# Altium schematic sheet Quadrature Mixers [FIXED WITH BIASING].SchDoc
size B
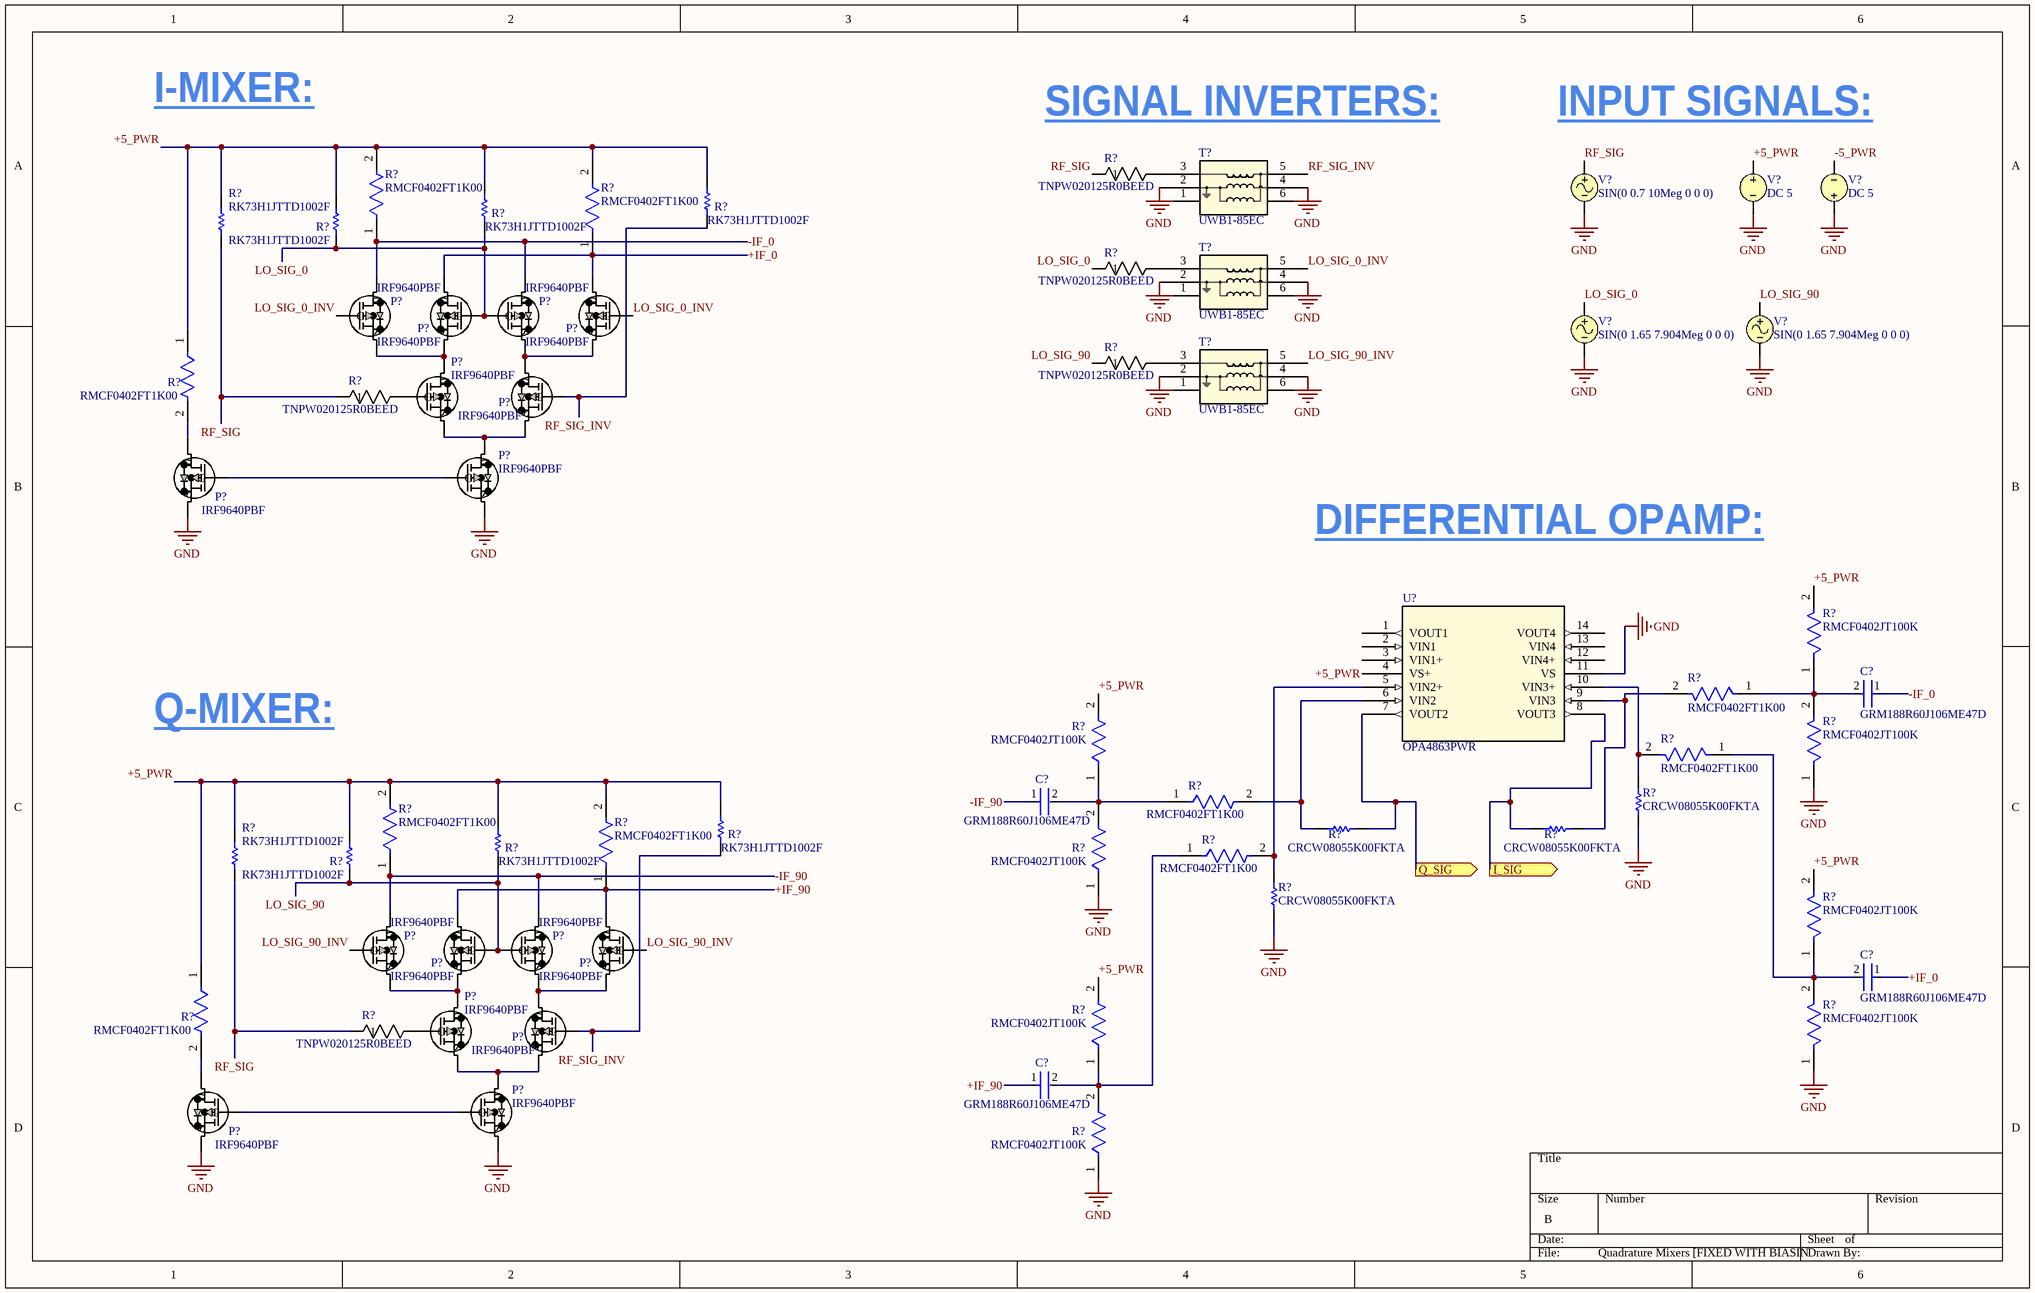
[diagram p0: Quadrature Mixers [FIXED WITH BIASING].SchDoc]

## Parts
(Parts that share a designator on the sheet are numbered #1, #2 ... from top to bottom, then left to right.)
C?#1  GRM188R60J106ME47D  [FP-GRM188-0_1-e0_2_0_55-IPC_A]
C?#2  GRM188R60J106ME47D  [FP-GRM188-0_1-e0_2_0_55-IPC_A]
C?#3  GRM188R60J106ME47D  [FP-GRM188-0_1-e0_2_0_55-IPC_A]
C?#4  GRM188R60J106ME47D  [FP-GRM188-0_1-e0_2_0_55-IPC_A]
P?#1  IRF9640PBF  [TO220AB_VIS]
P?#2  IRF9640PBF  [TO220AB_VIS]
P?#3  IRF9640PBF  [TO220AB_VIS]
P?#4  IRF9640PBF  [TO220AB_VIS]
P?#5  IRF9640PBF  [TO220AB_VIS]
P?#6  IRF9640PBF  [TO220AB_VIS]
P?#7  IRF9640PBF  [TO220AB_VIS]
P?#8  IRF9640PBF  [TO220AB_VIS]
P?#9  IRF9640PBF  [TO220AB_VIS]
P?#10  IRF9640PBF  [TO220AB_VIS]
P?#11  IRF9640PBF  [TO220AB_VIS]
P?#12  IRF9640PBF  [TO220AB_VIS]
P?#13  IRF9640PBF  [TO220AB_VIS]
P?#14  IRF9640PBF  [TO220AB_VIS]
P?#15  IRF9640PBF  [TO220AB_VIS]
P?#16  IRF9640PBF  [TO220AB_VIS]
R?#1  TNPW020125R0BEED  [RES_TNPW0201_VIS]
R?#2  RK73H1JTTD1002F  [RESC1608X55X30ML20T10]
R?#3  RK73H1JTTD1002F  [RESC1608X55X30ML20T10]
R?#4  RK73H1JTTD1002F  [RESC1608X55X30ML20T10]
R?#5  RK73H1JTTD1002F  [RESC1608X55X30ML20T10]
R?#6  RMCF0402FT1K00  [FP-RMCF0402-MFG]
R?#7  RMCF0402FT1K00  [FP-RMCF0402-MFG]
R?#8  TNPW020125R0BEED  [RES_TNPW0201_VIS]
R?#9  RMCF0402FT1K00  [FP-RMCF0402-MFG]
R?#10  TNPW020125R0BEED  [RES_TNPW0201_VIS]
R?#11  TNPW020125R0BEED  [RES_TNPW0201_VIS]
R?#12  RMCF0402JT100K  [FP-RMCF0402-MFG]
R?#13  RMCF0402FT1K00  [FP-RMCF0402-MFG]
R?#14  RMCF0402FT1K00  [FP-RMCF0402-MFG]
R?#15  RMCF0402JT100K  [FP-RMCF0402-MFG]
R?#16  RMCF0402JT100K  [FP-RMCF0402-MFG]
R?#17  RMCF0402FT1K00  [FP-RMCF0402-MFG]
R?#18  CRCW08055K00FKTA  [RESC2013X50X30ML20T20]
R?#19  CRCW08055K00FKTA  [RESC2013X50X30ML20T20]
R?#20  CRCW08055K00FKTA  [RESC2013X50X30ML20T20]
R?#21  RK73H1JTTD1002F  [RESC1608X55X30ML20T10]
R?#22  RK73H1JTTD1002F  [RESC1608X55X30ML20T10]
R?#23  RMCF0402FT1K00  [FP-RMCF0402-MFG]
R?#24  RK73H1JTTD1002F  [RESC1608X55X30ML20T10]
R?#25  RK73H1JTTD1002F  [RESC1608X55X30ML20T10]
R?#26  RMCF0402FT1K00  [FP-RMCF0402-MFG]
R?#27  RMCF0402FT1K00  [FP-RMCF0402-MFG]
R?#28  RMCF0402JT100K  [FP-RMCF0402-MFG]
R?#29  CRCW08055K00FKTA  [RESC2013X50X30ML20T20]
R?#30  RMCF0402FT1K00  [FP-RMCF0402-MFG]
R?#31  RMCF0402JT100K  [FP-RMCF0402-MFG]
R?#32  TNPW020125R0BEED  [RES_TNPW0201_VIS]
R?#33  RMCF0402JT100K  [FP-RMCF0402-MFG]
R?#34  RMCF0402JT100K  [FP-RMCF0402-MFG]
R?#35  RMCF0402JT100K  [FP-RMCF0402-MFG]
T?#1  UWB1-85EC  [UWB1UWB2_COC]
T?#2  UWB1-85EC  [UWB1UWB2_COC]
T?#3  UWB1-85EC  [UWB1UWB2_COC]
U?  OPA4863PWR  [PW14_TEX]
V?#1  SIN(0 0.7 10Meg 0 0 0)
V?#2  DC 5
V?#3  DC 5
V?#4  SIN(0 1.65 7.904Meg 0 0 0)
V?#5  SIN(0 1.65 7.904Meg 0 0 0)

## Ports
I_SIG (out), Q_SIG (out)

## Nets
GND: P?#7.3(S) P?#8.3(S) P?#15.3(S) P?#16.3(S) R?#16.1 R?#20.1 R?#28.1 R?#29.1 R?#34.1 R?#35.1 T?#1.2 T?#1.4 T?#2.2 T?#2.4 T?#3.2 T?#3.4 U?.11(VS) V?#1.2 V?#2.2 V?#3.1 V?#4.2 V?#5.2
+5_PWR: R?#2.2 R?#3.2 R?#4.2 R?#5.2 R?#6.2 R?#7.2 R?#9.1 R?#12.2 R?#15.2 R?#21.2 R?#22.2 R?#24.2 R?#25.2 R?#26.2 R?#27.2 R?#30.1 R?#31.2 R?#33.2 U?.4(VS+) V?#2.1
+IF_0: C?#3.1 P?#2.2(D) P?#4.2(D) R?#7.1
+IF_90: C?#4.1 P?#10.2(D) P?#12.2(D) R?#27.1
-5_PWR: V?#3.2
-IF_0: C?#1.1 P?#1.2(D) P?#3.2(D) R?#6.1
-IF_90: C?#2.1 P?#9.2(D) P?#11.2(D) R?#26.1
I_SIG: R?#19.1 U?.8(VOUT3) ; port I_SIG
LO_SIG_0: P?#2.1(G) P?#3.1(G) R?#3.1 R?#5.1 R?#8.1 V?#4.1
LO_SIG_0_INV: P?#1.1(G) P?#4.1(G) T?#2.5
LO_SIG_90: P?#10.1(G) P?#11.1(G) R?#10.1 R?#22.1 R?#25.1 V?#5.1
LO_SIG_90_INV: P?#9.1(G) P?#12.1(G) T?#3.5
Q_SIG: R?#18.2 U?.7(VOUT2) ; port Q_SIG
RF_SIG: R?#1.1 R?#4.1 R?#11.1 R?#24.1 R?#32.1 V?#1.1
RF_SIG_INV: P?#6.1(G) P?#14.1(G) R?#2.1 R?#21.1 T?#1.5
NetC?#1_2: C?#1.2 R?#12.1 R?#13.1 R?#16.2
NetC?#2_2: C?#2.2 R?#15.1 R?#17.1 R?#28.2
NetC?#3_2: C?#3.2 R?#14.1 R?#31.1 R?#34.2
NetC?#4_2: C?#4.2 R?#23.1 R?#33.1 R?#35.2
NetP?#1_3: P?#1.3(S) P?#2.3(S) P?#5.2(D)
NetP?#3_3: P?#3.3(S) P?#4.3(S) P?#6.2(D)
NetP?#5_1: P?#5.1(G) R?#11.2
NetP?#5_3: P?#5.3(S) P?#6.3(S) P?#8.2(D)
NetP?#7_1: P?#7.1(G) P?#8.1(G)
NetP?#7_2: P?#7.2(D) R?#9.2
NetP?#9_3: P?#9.3(S) P?#10.3(S) P?#13.2(D)
NetP?#11_3: P?#11.3(S) P?#12.3(S) P?#14.2(D)
NetP?#13_1: P?#13.1(G) R?#32.2
NetP?#13_3: P?#13.3(S) P?#14.3(S) P?#16.2(D)
NetP?#15_1: P?#15.1(G) P?#16.1(G)
NetP?#15_2: P?#15.2(D) R?#30.2
NetR?#1_2: R?#1.2 T?#1.3
NetR?#8_2: R?#8.2 T?#2.3
NetR?#10_2: R?#10.2 T?#3.3
NetR?#13_2: R?#13.2 R?#19.2 U?.9(VIN3)
NetR?#14_2: R?#14.2 R?#20.2 U?.10(VIN3+)
NetR?#17_2: R?#17.2 R?#18.1 U?.6(VIN2)
NetR?#23_2: R?#23.2 R?#29.2 U?.5(VIN2+)

Not connected (* = marked no-connect by the designer): T?#1 1 6; T?#2 1 6; T?#3 1 6; U? 1(VOUT1) 2(VIN1) 3(VIN1+) 12(VIN4+) 13(VIN4) 14(VOUT4)

## Notes on the sheet
- I-MIXER:
- SIGNAL INVERTERS:
- (near V?#3) INPUT SIGNALS:
- DIFFERENTIAL OPAMP:
- Q-MIXER:

## Library data of the parts
C?#1-C?#4 = CMP-2006-02792-2: Chip Multilayer Ceramic Capacitors for General Purpose, 0603, 10uF, X5R, 15%, 20%, 6.3V; Packaging: Tape and Reel; Voltage Rating (DC): 6.3V; Width: 0.031inch; Termination: SMD/SMT; Dielectric: X5R; Package Quantity: 4000; Voltage Rating: 6.3V; Capacitance: 10uF; Case/Package: 0603; Min Operating Temperature: -55°C; Voltage: 6.3V; Length: 1.6mm; Thickness: 0.035inch; Lead Free: Lead Free; Depth: 0.8mm; Case Code (Imperial): 0603; Max Operating Temperature: 85°C; Material: Ceramic; Height: 0.8mm; Tolerance: 20%; Mount: Surface Mount; REACH SVHC: No SVHC; Radiation Hardening: No; Case Code (Metric): 1608
P?#1-P?#16 = IRF9640PBF: No Description Available; Mfr_Name: Vishay
R?#1 R?#8 R?#10 R?#11 R?#32 = TNPW020125R0BEED: RES 25 OHM 0.1% 0.075W 0201; Mfr_Name: Vishay
R?#2-R?#5 R?#21 R?#22 R?#24 R?#25 = CMP-2000-01099-1: Manufacturer: KOA Speer; Part Number: RK73H1JTTD1002F
R?#6 R?#7 R?#9 R?#13 R?#14 R?#17 R?#23 R?#26 R?#27 R?#30 = CMP-26527-000026-1: 1kΩ ±1% 0.063W 0402 Thick Film Chip Resistor AEC-Q200 compliant; Resistance: 1kR; Temperature Coefficient: 100ppm/°C; Power Rating: 63mW; Length: 1mm; RoHS Compliant: Yes; Construction: Rectangular; Height: 0.016inch; Size Code: 0402; Lead Free: Lead Free; Radiation Hardening: No; Tolerance: 1%; Width: 0.02inch; Military Standard: Not; Resistor Type: Thick Film; Number of Terminations: 2; Min Operating Temperature: -55°C; Max Operating Temperature: 155°C; Depth: 0.5mm; Features: Automotive AEC-Q200; Packaging: Tape and Reel; Case Code (Metric): 1005; Mount: Surface Mount; Contact Plating: Tin; Max Power Dissipation: 63mW; Case/Package: 0402; Case Code (Imperial): 0402; Series: RMCF
R?#12 R?#15 R?#16 R?#28 R?#31 R?#33-R?#35 = CMP-26527-006953-1: 100kΩ ±5% 0.063W 0402 Thick Film Chip Resistor AEC-Q200 compliant; Working Voltage: 50V; Temperature Coefficient: 100ppm/°C; Power Rating: 62.5mW; Resistance: 100kR; Max Power Dissipation: 63mW; Military Standard: Not; Features: Automotive AEC-Q200; Case Code (Metric): 1005; Max Operating Temperature: 155°C; Lead Free: Lead Free; Series: RMCF; Number of Terminations: 2; Radiation Hardening: No; Length: 1mm; Contact Plating: Tin; Depth: 0.5mm; Min Operating Temperature: -55°C; Technology: THICK FILM; Case/Package: 0402; RoHS Compliant: Yes; Construction: Rectangular; Tolerance: 5%; Packaging: Tape and Reel; Resistor Type: Thick Film; Height: 0.016inch; Width: 0.02inch; Mount: Surface Mount; Case Code (Imperial): 0402
R?#18-R?#20 R?#29 = CMP-2001-04239-1: Manufacturer: Vishay Dale; Part Number: CRCW08055K00FKTA
T?#1-T?#3 = UWB1-85EC: • 3 dB bandwidth: 1 MHz to 8.5 GHz • 1/4 Watt RF input power • 250 mA max current rating • AEC-Q200 Grade 1 (–40°C to +125°C); Mfr_Name: Coilcraft; RefDes: RefDes; Type: Type
U? = OPA4863PWR: No Description Available; Mfr_Name: Texas Instruments; Type: Linear; RefDes: RefDes
V?#1 = VSIN: Sinusoidal Voltage Source; Note: PCB Footprint - Not required; Offset: 0; Amplitude: 0.7; AC Magnitude: 1; Published: 8-Jun-2000; LatestRevisionDate: 15-Nov-2004; LatestRevisionNote: Corrected Netlist.; PackageReference: Not Applicable; Publisher: Altium Limited; Frequency: 10Meg; Delay: 0; Damping Factor: 0; Phase: 0; DC Magnitude: 0; AC Phase: 0
V?#2 V?#3 = VSRC: Voltage Source; Note: PCB Footprint - Not required; AC Magnitude: 1; AC Phase: 0; Value: 5; Published: 8-Jun-2000; LatestRevisionDate: 17-Jul-2002; LatestRevisionNote: Re-released for DXP Platform.; PackageReference: Not Applicable; Publisher: Altium Limited
V?#4 = VSIN: Sinusoidal Voltage Source; Note: PCB Footprint - Not required; Offset: 0; Amplitude: 1.65; AC Magnitude: 1; Published: 8-Jun-2000; LatestRevisionDate: 15-Nov-2004; LatestRevisionNote: Corrected Netlist.; PackageReference: Not Applicable; Publisher: Altium Limited; Frequency: 7.904Meg; Delay: 0; Damping Factor: 0; Phase: 0; DC Magnitude: 0; AC Phase: 0
V?#5 = VSIN: Sinusoidal Voltage Source; Note: PCB Footprint - Not required; Offset: 0; Amplitude: 1.65; AC Magnitude: 1; AC Phase: 90; Published: 8-Jun-2000; LatestRevisionDate: 15-Nov-2004; LatestRevisionNote: Corrected Netlist.; PackageReference: Not Applicable; Publisher: Altium Limited; Frequency: 7.904Meg; Delay: 0; Damping Factor: 0; Phase: 0; DC Magnitude: 0